# EAGLE design IrrigationManager (EAGLE 9.6.1)
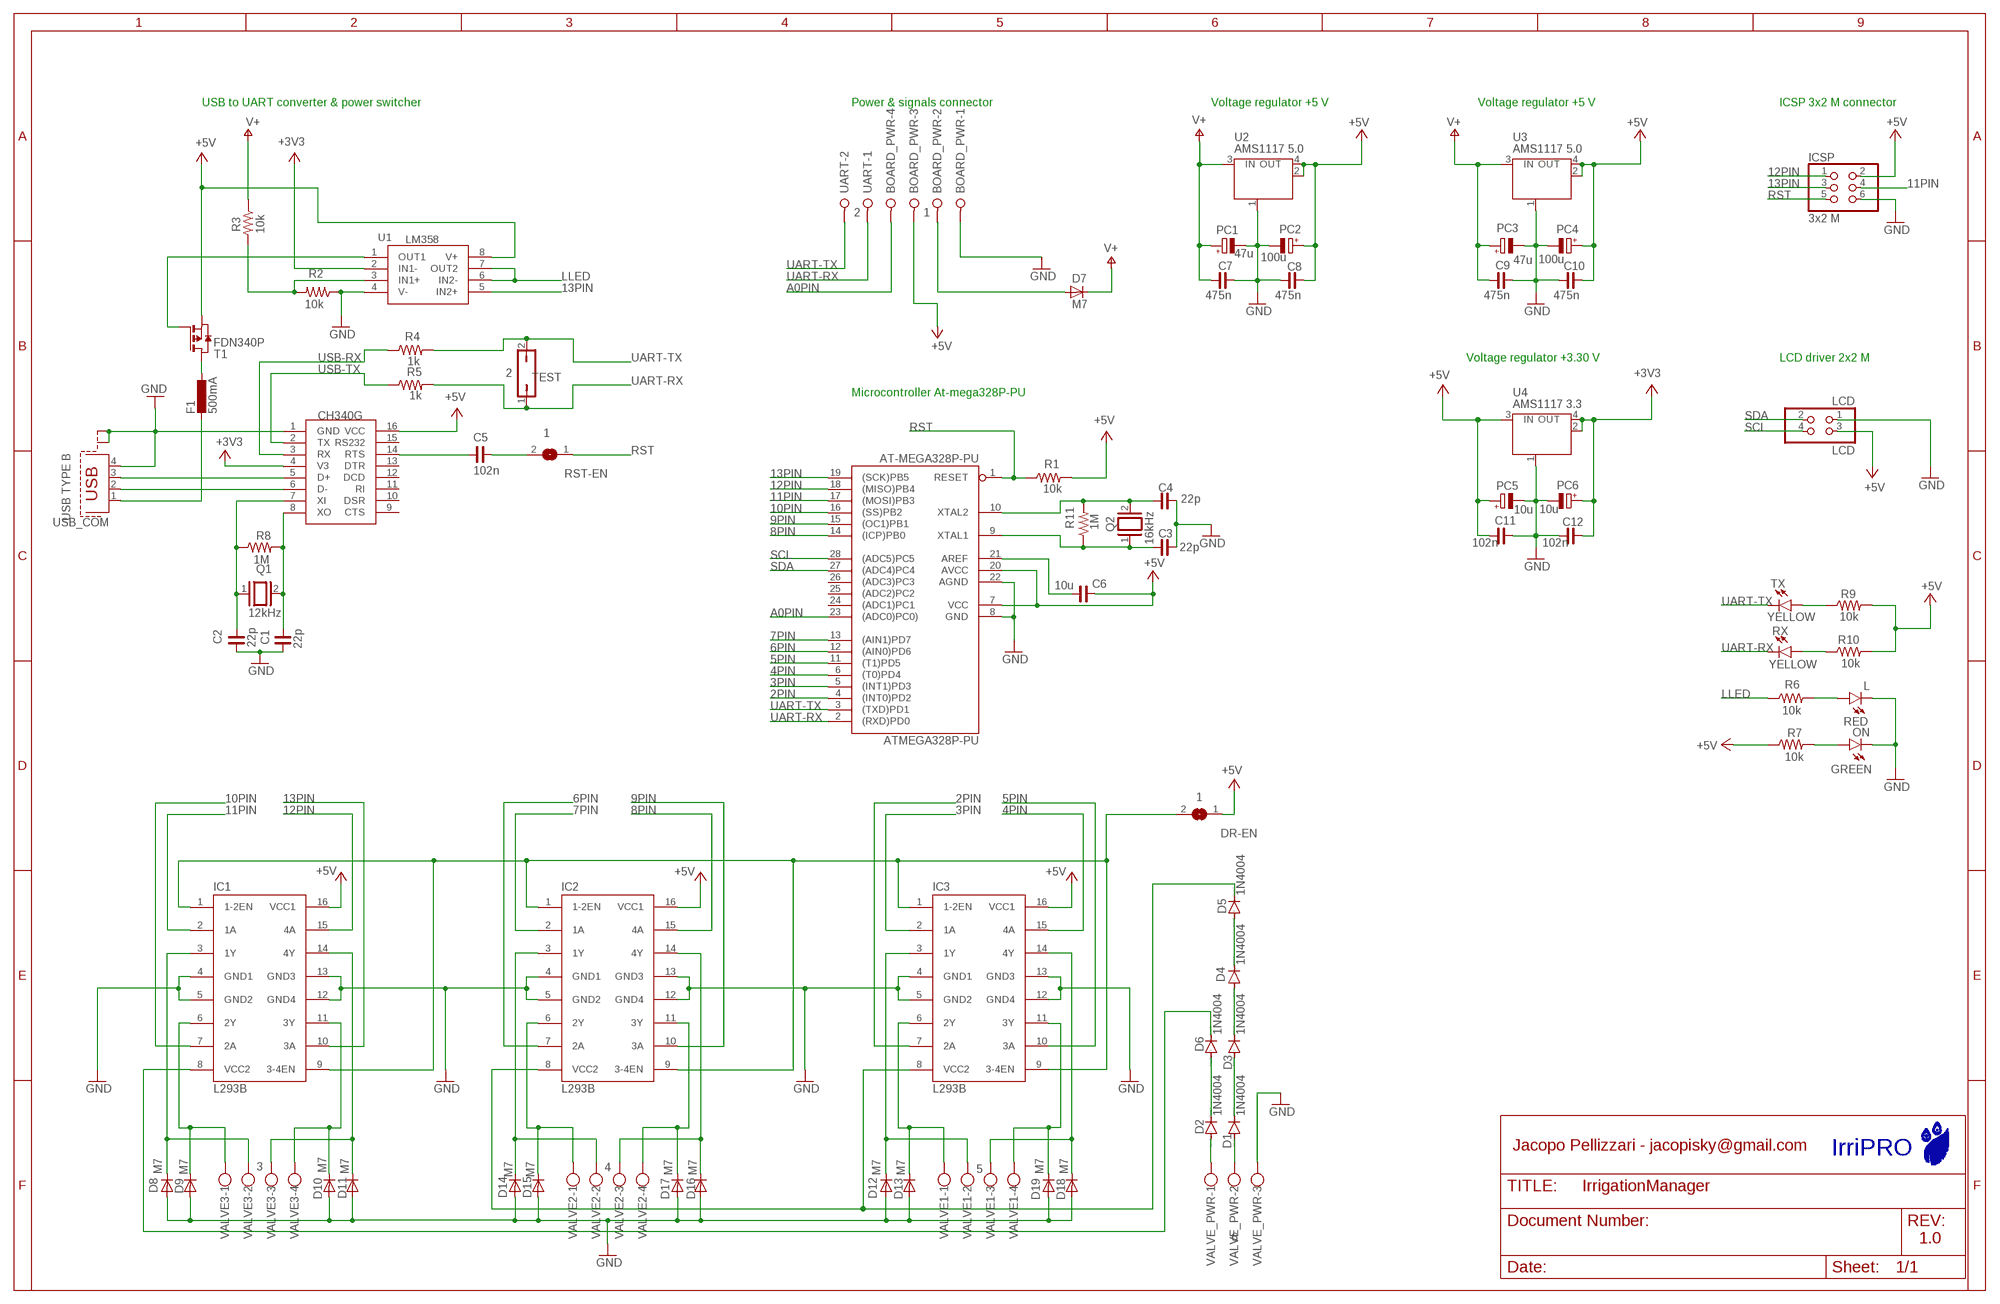
[diagram p0: schematic, sheet 1]

## Parts
AT-MEGA328P-PU  ATMEGA328P-PU  [DIL28-3]
BOARD_PWR  1  W237-04P  [W237-4P]
C1  22p  C_1206  [C1206]
C2  22p  C_1206  [C1206]
C3  22p  C_1206  [C1206]
C4  22p  C_1206  [C1206]
C5  102n  C_1206  [C1206]
C6  10u  C_1206  [C1206]
C7  475n  C_1206  [C1206]
C8  475n  C_1206  [C1206]
C9  475n  C_1206  [C1206]
C10  475n  C_1206  [C1206]
C11  102n  C_1206  [C1206]
C12  102n  C_1206  [C1206]
D1  1N4004  [DO41-10]
D2  1N4004  [DO41-10]
D3  1N4004  [DO41-10]
D4  1N4004  [DO41-10]
D5  1N4004  [DO41-10]
D6  1N4004  [DO41-10]
D7  M7  DIODE-SMB  [SMB]
D8  M7  DIODE-SMB  [SMB]
D9  M7  DIODE-SMB  [SMB]
D10  M7  DIODE-SMB  [SMB]
D11  M7  DIODE-SMB  [SMB]
D12  M7  DIODE-SMB  [SMB]
D13  M7  DIODE-SMB  [SMB]
D14  M7  DIODE-SMB  [SMB]
D15  M7  DIODE-SMB  [SMB]
D16  M7  DIODE-SMB  [SMB]
D17  M7  DIODE-SMB  [SMB]
D18  M7  DIODE-SMB  [SMB]
D19  M7  DIODE-SMB  [SMB]
DR-EN  1  SJ  [SJ]
F1  500mA  L-EUL1812  [L1812]
IC1  L293B  L293D  [DIL16]
IC2  L293B  L293D  [DIL16]
IC3  L293B  L293D  [DIL16]
ICSP  3x2 M  PINHD-2X3  [2X03]
L  RED  LEDCHIPLED_1206  [CHIPLED_1206]
LCD  LCD  PINHD-2X2  [2X02]
ON  GREEN  LEDCHIPLED_1206  [CHIPLED_1206]
PC1  47u  CPOL-EUD  [PANASONIC_D]
PC2  100u  CPOL-EUD  [PANASONIC_D]
PC3  47u  CPOL-EUD  [PANASONIC_D]
PC4  100u  CPOL-EUD  [PANASONIC_D]
PC5  10u  CPOL-EU153CLV-0405  [153CLV-0405]
PC6  10u  CPOL-EU153CLV-0405  [153CLV-0405]
Q1  12kHz  XTAL/S  [QS]
Q2  16kHz  XTAL/S  [QS]
R1  10k  ERJ-8GEY0R00V  [RES_1206]
R2  10k  ERJ-8GEY0R00V  [RES_1206]
R3  10k  ERJ-8GEY0R00V  [RES_1206]
R4  1k  ERJ-8GEY0R00V  [RES_1206]
R5  1k  ERJ-8GEY0R00V  [RES_1206]
R6  10k  ERJ-8GEY0R00V  [RES_1206]
R7  10k  ERJ-8GEY0R00V  [RES_1206]
R8  1M  ERJ-8GEY0R00V  [RES_1206]
R9  10k  ERJ-8GEY0R00V  [RES_1206]
R10  10k  ERJ-8GEY0R00V  [RES_1206]
R11  1M  ERJ-8GEY0R00V  [RES_1206]
RST-EN  1  SJ  [SJ]
RX  YELLOW  LEDCHIPLED_1206  [CHIPLED_1206]
T1  FDN340P  PMOSSOT23  [SOT-23]
TEST  2  JP1Q  [JP1]
TX  YELLOW  LEDCHIPLED_1206  [CHIPLED_1206]
U1  LM358  LM358DR  [LM358DR]
U2  AMS1117 5.0  MC33269ST-3.3T3  [SOT223]
U3  AMS1117 5.0  MC33269ST-3.3T3  [SOT223]
U4  AMS1117 3.3  MC33269ST-3.3T3  [SOT223]
U$1  CH340G  [SOIC16]
UART  2  W237-02P  [W237-132]
USB_COM  USB TYPE B  PN61729-S  [PN61729-S]
VALVE1  5  W237-04P  [W237-4P]
VALVE2  4  W237-04P  [W237-4P]
VALVE3  3  W237-04P  [W237-4P]
VALVE_PWR  6  W237-03P  [W237-133]

## Nets
2PIN: AT-MEGA328P-PU.4((INT0)PD2) IC3.7(2A)
3PIN: AT-MEGA328P-PU.5((INT1)PD3) IC3.2(1A)
4PIN: AT-MEGA328P-PU.6((T0)PD4) IC3.15(4A)
5PIN: AT-MEGA328P-PU.11((T1)PD5) IC3.10(3A)
5VP: T1.3(G) U1.1(OUT1)
6PIN: AT-MEGA328P-PU.12((AIN0)PD6) IC2.7(2A)
7PIN: AT-MEGA328P-PU.13((AIN1)PD7) IC2.2(1A)
8PIN: AT-MEGA328P-PU.14((ICP)PB0) IC2.15(4A)
9PIN: AT-MEGA328P-PU.15((OC1)PB1) IC2.10(3A)
10PIN: AT-MEGA328P-PU.16((SS)PB2) IC1.7(2A)
11PIN: AT-MEGA328P-PU.17((MOSI)PB3) IC1.2(1A) ICSP.4
12PIN: AT-MEGA328P-PU.18((MISO)PB4) IC1.15(4A) ICSP.1
13PIN: AT-MEGA328P-PU.19((SCK)PB5) IC1.10(3A) ICSP.3 U1.5(IN2+)
+3V3: C12.2 PC6.+ U1.2(IN1-) U4.2(OUT) U4.4(OUT) U$1.4(V3)
+5V: AT-MEGA328P-PU.7(VCC) AT-MEGA328P-PU.20(AVCC) BOARD_PWR.3 C6.2 C8.2 C10.2 C11.1 DR-EN.1 IC1.16(VCC1) IC2.16(VCC1) IC3.16(VCC1) ICSP.2 LCD.3 PC2.+ PC4.+ PC5.+ R1.2 R7.1 R9.2 R10.2 T1.2(S) U1.8(V+) U2.2(OUT) U2.4(OUT) U3.2(OUT) U3.4(OUT) U4.3(IN) U$1.16(VCC)
+9V: D6.C IC1.8(VCC2)
+9V7: D2.C D6.A
+10V4: D2.A VALVE_PWR.1
+20V: D5.C IC2.8(VCC2) IC3.8(VCC2)
+20V7: D4.C D5.A
+21V4: D3.C D4.A
+22V1: D1.C D3.A
+22V8: D1.A VALVE_PWR.2
A0PIN: AT-MEGA328P-PU.23((ADC0)PC0)) BOARD_PWR.4
CRST: C5.1 U$1.14(RTS)
DRIVEREN: DR-EN.2 IC1.1(1-2EN) IC1.9(3-4EN) IC2.1(1-2EN) IC2.9(3-4EN) IC3.1(1-2EN) IC3.9(3-4EN)
FUSE5V: F1.1 T1.1(D)
GND: AT-MEGA328P-PU.8(GND) AT-MEGA328P-PU.22(AGND) BOARD_PWR.1 C1.1 C2.1 C3.2 C4.2 C7.2 C8.1 C9.2 C10.1 C11.2 C12.1 D8.A D9.A D10.A D11.A D12.A D13.A D14.A D15.A D16.A D17.A D18.A D19.A IC1.4(GND1) IC1.5(GND2) IC1.12(GND4) IC1.13(GND3) IC2.4(GND1) IC2.5(GND2) IC2.12(GND4) IC2.13(GND3) IC3.4(GND1) IC3.5(GND2) IC3.12(GND4) IC3.13(GND3) ICSP.6 L.C LCD.1 ON.C PC1.- PC2.- PC3.- PC4.- PC5.- PC6.- R2.1 U1.4(V-) U2.1(GND/ADJ) U3.1(GND/ADJ) U4.1(GND/ADJ) U$1.1(GND) USB_COM.4 USB_COM.S1 USB_COM.S2 VALVE_PWR.3
HV2: D13.C IC3.6(2Y) VALVE1.1
HV3: D12.C IC3.3(1Y) VALVE1.2
HV4: D18.C IC3.14(4Y) VALVE1.3
HV5: D19.C IC3.11(3Y) VALVE1.4
HV6: D15.C IC2.6(2Y) VALVE2.1
HV7: D14.C IC2.3(1Y) VALVE2.2
HV8: D16.C IC2.14(4Y) VALVE2.3
HV9: D17.C IC2.11(3Y) VALVE2.4
HV10: D9.C IC1.6(2Y) VALVE3.1
HV11: D8.C IC1.3(1Y) VALVE3.2
HV12: D11.C IC1.14(4Y) VALVE3.3
HV13: D10.C IC1.11(3Y) VALVE3.4
LLED: R6.1 U1.6(IN2-) U1.7(OUT2)
N$2: C1.2 Q1.2 R8.2 U$1.8(XO)
N$3: C2.2 Q1.1 R8.1 U$1.7(XI)
N$4: U$1.6(D-) USB_COM.2
N$5: AT-MEGA328P-PU.9(XTAL1) C3.1 Q2.1 R11.1
N$6: AT-MEGA328P-PU.10(XTAL2) C4.1 Q2.2 R11.2
N$7: U$1.5(D+) USB_COM.3
N$14: R2.2 R3.2 U1.3(IN1+)
N$16: C5.2 RST-EN.2
N$30: R9.1 TX.A
N$51: R10.1 RX.A
N$54: AT-MEGA328P-PU.21(AREF) C6.1
P13LED: L.A R6.2
PWRLED: ON.A R7.2
RST: AT-MEGA328P-PU.1(RESET) ICSP.5 R1.1 RST-EN.1
SCL: AT-MEGA328P-PU.28((ADC5)PC5) LCD.4
SDA: AT-MEGA328P-PU.27((ADC4)PC4) LCD.2
UART-RX: AT-MEGA328P-PU.2((RXD)PD0) R5.2 RX.C TEST.1 UART.1
UART-TX: AT-MEGA328P-PU.3((TXD)PD1) R4.2 TEST.2 TX.C UART.2
USB5V: F1.2 USB_COM.1
USB-RX: R4.1 U$1.3(RX)
USB-TX: R5.1 U$1.2(TX)
V+: C7.1 C9.1 D7.C PC1.+ PC3.+ R3.1 U2.3(IN) U3.3(IN)
VIN: BOARD_PWR.2 D7.A
Unconnected: AT-MEGA328P-PU.24((ADC1)PC1) AT-MEGA328P-PU.25((ADC2)PC2) AT-MEGA328P-PU.26((ADC3)PC3) U$1.9(CTS) U$1.10(DSR) U$1.11(RI) U$1.12(DCD) U$1.13(DTR) U$1.15(RS232)

## Notes on the sheet
- USB to UART converter & power switcher | Power & signals connector | Voltage regulator +5 V | Voltage regulator +5 V | ICSP 3x2 M connector
- Voltage regulator +3.30 V | LCD driver 2x2 M
- Microcontroller At-mega328P-PU
- Jacopo Pellizzari - jacopisky@gmail.com
- IrriPRO
- 1.0

## Library data of the parts
AT-MEGA328P-PU = SmartPrj:ATMEGA328P-: MICROCONTROLLER 4 Kbytes FLASH 128 bytes SRAM 256 bytes EEPROM UART 6-channel 10 bit ADC
BOARD_PWR = con-wago-508:W237-04P: WAGO SREW CLAMP; OC_FARNELL: unknown; OC_NEWARK: unknown
C1-C12 = rc-master-smd:C_: NON-POLARIZED CAP
D1-D6 = diode:1N4004: DIODE general purpose rectifier, 1 A
D7-D19 = diode:DIODE-: DIODE
DR-EN RST-EN = jumper:SJ: SMD solder JUMPER
F1 = rcl:L-EU: INDUCTOR, European symbol
IC1-IC3 = st-microelectronics:L293D: PUSH-PULL 4 CHANNEL DRIVER; MPN: L293D; OC_FARNELL: 9589619; OC_NEWARK: 56P8249
ICSP = SmartPrj:PINHD-2X3: PIN HEADER
L ON RX TX = led:LED: LED OSRAM: - CHIPLED LG R971, LG N971, LY N971, LG Q971, LY Q971, LO R971, LY R971 LH N974, LH R974 LS Q976, LO Q976, LY Q976 LO Q996 - Hyper CHIPLED LW Q18S LB Q993, LB Q99A, LB R99A - SideLED LS A670, LO A670, LY A670, LG A670, LP A670 LB A673, LV A673, LT A673, LW A673 LH A674 LY A675 LS A676, LA A676, LO A676, LY A676, LW A676 LS A679, LY A679, LG A679 - Hyper Micro SIDELED® LS Y876, LA Y876, LO Y876, LY Y876 LT Y87S - SmartLED LW L88C, LW L88S LB L89C, LB L89S, LG L890 LS L89K, LO L89K, LY L89K LS L896, LA L896, LO L896, LY L896 - TOPLED LS T670, LO T670, LY T670, LG T670, LP T670 LSG T670, LSP T670, LSY T670, LOP T670, LYG T670 LG T671, LOG T671, LSG T671 LB T673, LV T673, LT T673, LW T673 LH T674 LS T676, LA T676, LO T676, LY T676, LB T676, LH T676, LSB T676, LW T676 LB T67C, LV T67C, LT T67C, LS T67K, LO T67K, LY T67K, LW E67C LS E67B, LA E67B, LO E67B, LY E67B, LB E67C, LV E67C, LT E67C LW T67C LS T679, LY T679, LG T679 LS T770, LO T770, LY T770, LG T770, LP T770 LB T773, LV T773, LT T773, LW T773 LH T774 LS E675, LA E675, LY E675, LS T675 LS T776, LA T776, LO T776, LY T776, LB T776 LHGB T686 LT T68C, LB T68C - Hyper Mini TOPLED® LB M676 - Mini TOPLED Santana® LG M470 LS M47K, LO M47K, LY M47K Source: http://www.osram.convergy.de LUXEON: - LUMILED® LXK2-PW12-R00, LXK2-PW12-S00, LXK2-PW14-U00, LXK2-PW14-V00 LXK2-PM12-R00, LXK2-PM12-S00, LXK2-PM14-U00 LXK2-PE12-Q00, LXK2-PE12-R00, LXK2-PE12-S00, LXK2-PE14-T00, LXK2-PE14-U00 LXK2-PB12-K00, LXK2-PB12-L00, LXK2-PB12-M00, LXK2-PB14-N00, LXK2-PB14-P00, LXK2-PB14-Q00 LXK2-PR12-L00, LXK2-PR12-M00, LXK2-PR14-Q00, LXK2-PR14-R00 LXK2-PD12-Q00, LXK2-PD12-R00, LXK2-PD12-S00 LXK2-PH12-R00, LXK2-PH12-S00 LXK2-PL12-P00, LXK2-PL12-Q00, LXK2-PL12-R00 Source: www.luxeon.com KINGBRIGHT: KA-3528ASYC Source: www.kingbright.com
LCD = SmartPrj:PINHD-2X2: PIN HEADER
PC1-PC4 = rcl:CPOL-EU: POLARIZED CAPACITOR, European symbol
PC5 PC6 = rcl:CPOL-EU: POLARIZED CAPACITOR, European symbol; SPICEPREFIX: C
Q1 Q2 = special:XTAL/S: CRYSTAL
R1-R11 = Resistor_Capacitor:ERJ-8GEY0R00V: RES SMD 0 OHM JUMPER 1/4W 1206 Manufacturer's datasheet <https://industrial.panasonic.com/ww/products/resistors/chip-resistors/general-purpose-chip-resistors/thick-film-chip-resistors/ERJ8GEY0R00V>; CREATED_BY: PCBLayout.com; DIGIKEY_PART_NUMBER: P0.0ETR-ND; MANUFACTURER: Panasonic Electronic Components; MPN: ERJ-8GEY0R00V; PACKAGE: SMD 1206
T1 = zetex:PMOSSOT23: MOS FET
TEST = jumper:JP1Q: JUMPER
U1 = IC:LM358DR: IC OPAMP GP 2 CIRCUIT 8SOIC Manufacturer's datasheet <http://www.ti.com/lit/ds/symlink/lm358.pdf>; CREATED_BY: PCBLayout.com; DIGIKEY_PART_NUMBER: 296-1014-1-ND; MANUFACTURER: Texas Instruments; MPN: LM358DR; PACKAGE: 8-SOIC
U2-U4 = linear:MC33269ST*: Adjustable Output Low Dropout Voltage Regulator 800 mA Source: http://www.onsemi.com/pub/Collateral/MC33269-D.PDF
U$1 = ch340g:CH340G
UART = con-wago-508:W237-02P: WAGO SREW CLAMP; OC_FARNELL: unknown; OC_NEWARK: unknown
USB_COM = con-berg:PN61729-S: BERG USB connector; OC_FARNELL: unknown; OC_NEWARK: unknown
VALVE1-VALVE3 = con-wago-508:W237-04P: WAGO SREW CLAMP
VALVE_PWR = con-wago-508:W237-03P: WAGO SREW CLAMP

## Board
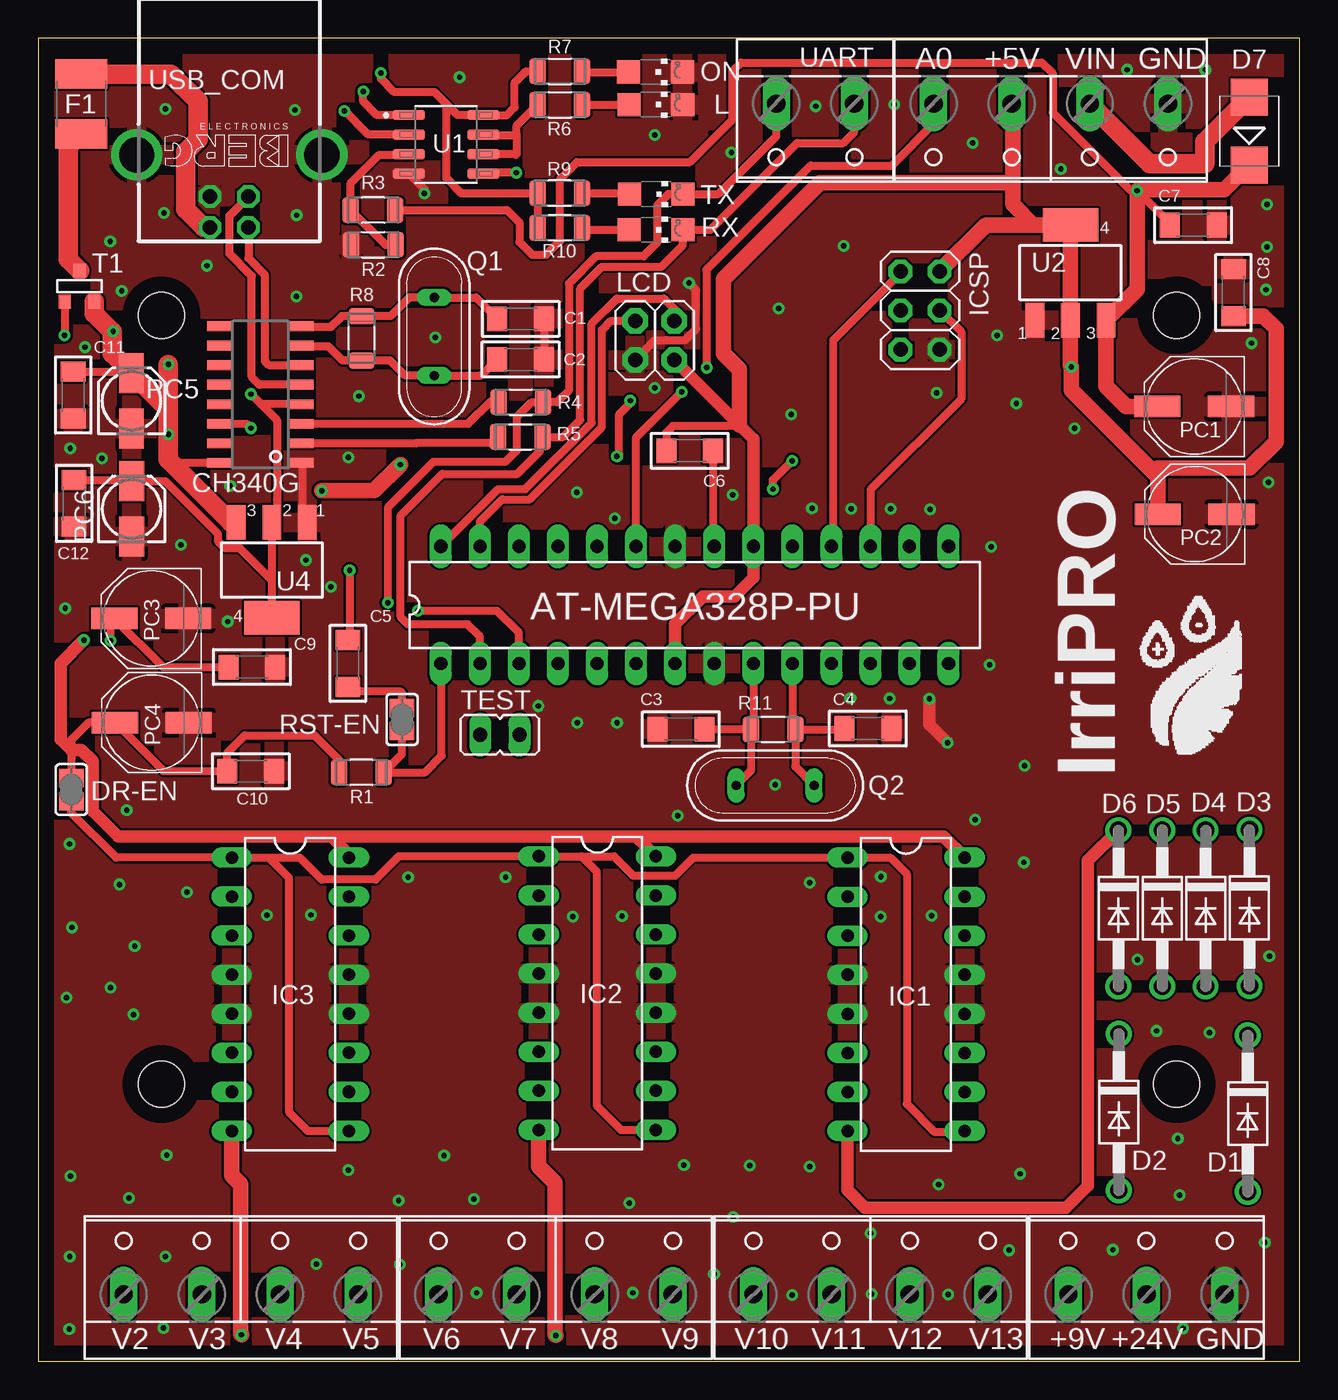
[diagram p1: board, top side]
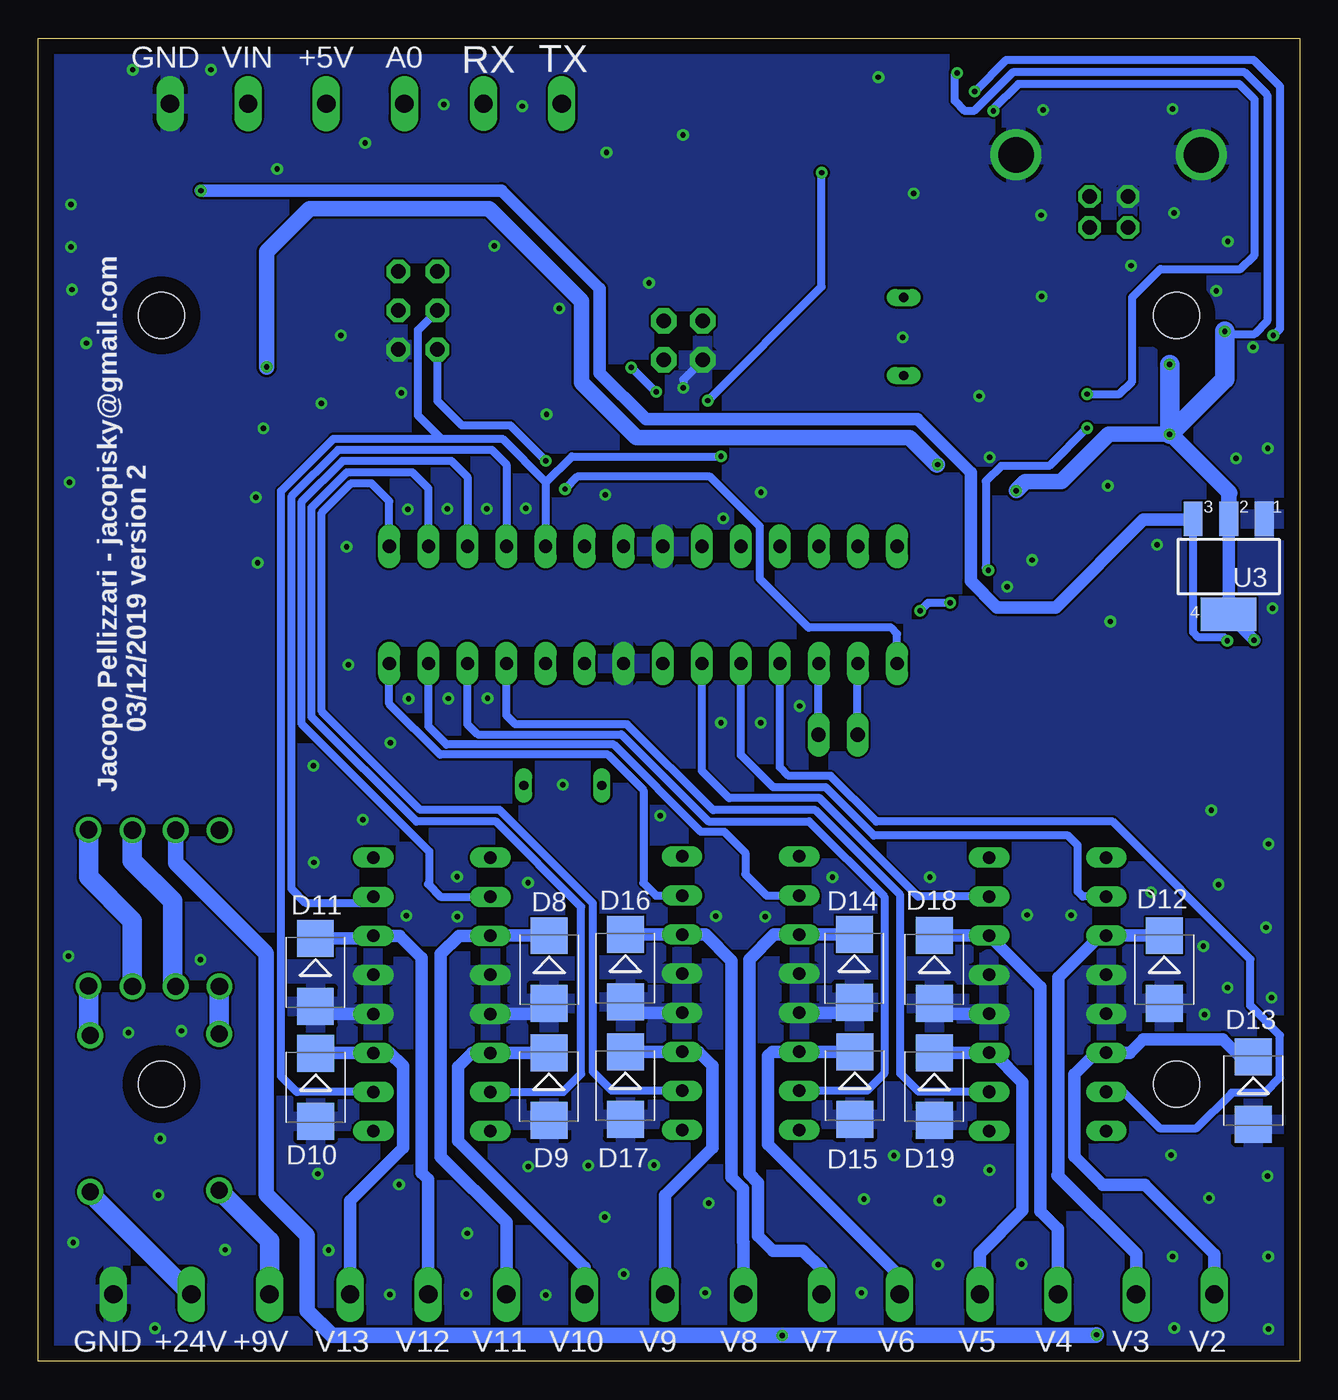
[diagram p2: board, bottom side, seen from below]

Size 82 x 86 mm. Coordinates in mm from the lower left corner, seen from the top.
Outline: 0,0 82,0 82,86 0,86 0,0
Copper layers (1*16): Top 0.035mm / dielectric 1.5mm / Bottom 0.035mm
Design rules "default": minimum track width 6mil, minimum drill 0.35mm, track to track 6mil, track to pad 6mil, pad to pad 6mil, via to via 6mil, smd to smd 6mil, copper to edge 40mil, drill to drill 6mil, minimum pad ring 10mil, minimum via ring 8mil, stop-mask expansion 4mil, vias tented up to drill 0mil, thermal gap 10mil
Holes 3 mm at 8,18 74,18 74,68 8,68

### Footprints (pad centres in the part's own frame; a part is rotated, then mirrored left to right if it is on the bottom)
DIL28-3 = drill 0.85 pad 1.422 long: 1 -16.51,-3.81; 2 -13.97,-3.81; 3 -11.43,-3.81; 4 -8.89,-3.81; 5 -6.35,-3.81; 6 -3.81,-3.81; 7 -1.27,-3.81; 8 1.27,-3.81; 9 3.81,-3.81; 10 6.35,-3.81; 11 8.89,-3.81; 12 11.43,-3.81; 13 13.97,-3.81; 14 16.51,-3.81; 15 16.51,3.81; 16 13.97,3.81; 17 11.43,3.81; 18 8.89,3.81; 19 6.35,3.81; 20 3.81,3.81; 21 1.27,3.81; 22 -1.27,3.81; 23 -3.81,3.81; 24 -6.35,3.81; 25 -8.89,3.81; 26 -11.43,3.81; 27 -13.97,3.81; 28 -16.51,3.81
W237-4P = drill 1.194 long: 1 -7.62,-0.635; 2 -2.54,-0.635; 3 2.54,-0.635; 4 7.62,-0.635
C1206 = smd 1.3 x 1.6: 1 -1.524,0; 2 1.524,0
DO41-10 = drill 1.118: A 5.08,0; C -5.08,0
SMB = smd 2.4 x 2.4: A 2.2,0; C -2.2,0
SJ = smd 1.168 x 1.6: 1 -0.762,0; 2 0.762,0
L1812 = smd 1.9 x 3.4: 1 -1.95,0; 2 1.95,0
DIL16 = drill 0.813 long: 1 -8.89,-3.81; 2 -6.35,-3.81; 3 -3.81,-3.81; 4 -1.27,-3.81; 5 1.27,-3.81; 6 3.81,-3.81; 7 6.35,-3.81; 8 8.89,-3.81; 9 8.89,3.81; 10 6.35,3.81; 11 3.81,3.81; 12 1.27,3.81; 13 -1.27,3.81; 14 -3.81,3.81; 15 -6.35,3.81; 16 -8.89,3.81
2X03 = drill 0.95 pad 1.55 octagon: 1 -2.54,-1.27; 2 -2.54,1.27; 3 0,-1.27; 4 0,1.27; 5 2.54,-1.27; 6 2.54,1.27
CHIPLED_1206 = smd 1.5 x 1.5: A 0,-1.75; C 0,1.75
2X02 = drill 0.95 pad 1.676 octagon: 1 -1.27,-1.27; 2 -1.27,1.27; 3 1.27,-1.27; 4 1.27,1.27
PANASONIC_D = smd 3 x 1.4: + 2.4,0; - -2.4,0
153CLV-0405 = smd 2.6 x 1.6: + 1.8,0; - -1.8,0
QS = drill 0.61 long: 1 -2.54,0; 2 2.54,0
RES_1206 = smd 1.08 x 1.68: 1 -1.445,0; 2 1.445,0
SOT-23 = smd 0.787 x 0.889: 1 0.025,-1.016; 2 -0.94,1.016; 3 0.991,1.016
JP1 = drill 0.914 long: 1 0,-1.27; 2 0,1.27
LM358DR = smd 0.66 x 2.07: 1 -1.905,-2.42; 2 -0.635,-2.42; 3 0.635,-2.42; 4 1.905,-2.42; 5 1.905,2.42; 6 0.635,2.42; 7 -0.635,2.42; 8 -1.905,2.42
SOT223 = smd 1.219 x 2.235: 1 -2.311,-3.099; 2 0,-3.099; 3 2.311,-3.099 | smd 3.6 x 2.2: 4 0,3.099
SOIC16 = smd 0.635 x 1.524: 1 -4.445,-2.695; 2 -3.175,-2.695; 3 -1.905,-2.695; 4 -0.635,-2.695; 5 0.635,-2.695; 6 1.905,-2.695; 7 3.175,-2.695; 8 4.445,-2.695; 9 4.445,2.695; 10 3.175,2.695; 11 1.905,2.695; 12 0.635,2.695; 13 -0.635,2.695; 14 -1.905,2.695; 15 -3.175,2.695; 16 -4.445,2.695
W237-132 = drill 1.194 long: 1 -2.54,-0.635; 2 2.54,-0.635
PN61729-S = drill 0.95 octagon: 1 1.25,4.71; 2 -1.25,4.71; 3 -1.25,2.71; 4 1.25,2.71 | drill 2.3 pad 2.9: S1 -6.02,0; S2 6.02,0
W237-133 = drill 1.194 long: 1 -5.08,-0.635; 2 0,-0.635; 3 5.08,-0.635

### Placement (x,y rotation side)
AT-MEGA328P-PU  42.67,49.17 0 top
BOARD_PWR  65.83,81.12 180 top
C1  31.36,67.77 180 top
C2  31.35,65.13 180 top
C3  41.78,41.09 180 top
C4  53.93,41.13 0 top
C5  20.12,45.36 270 top
C6  42.35,59.19 180 top
C7  75.09,73.86 0 top
C8  77.7,69.48 270 top
C9  13.88,45.12 0 top
C10  13.81,38.35 180 top
C11  2.26,62.82 270 top
C12  2.32,55.77 90 top
D1  78.63,16.09 270 top
D2  70.25,16.18 270 top
D3  78.75,29.46 270 top
D4  75.89,29.43 270 top
D5  73.07,29.44 270 top
D6  70.23,29.44 270 top
D7  78.73,79.97 90 top
D8  48.79,25.46 270 bottom
D9  48.81,17.85 270 bottom
D10  63.98,17.79 270 bottom
D11  63.99,25.27 270 bottom
D12  8.79,25.46 270 bottom
D13  3.01,17.59 270 bottom
D14  28.95,25.53 270 bottom
D15  28.92,17.92 270 bottom
D16  43.84,25.54 270 bottom
D17  43.83,17.91 270 bottom
D18  23.75,25.47 270 bottom
D19  23.75,17.84 270 bottom
DR-EN  2.14,37.16 270 top
F1  2.78,81.74 90 top
IC1  56.42,23.84 270 top
IC2  36.34,23.92 270 top
IC3  16.37,23.85 270 top
ICSP  57.33,68.32 270 top
L  40.14,81.7 270 top
LCD  40.08,66.37 0 top
ON  40.13,83.82 270 top
PC1  75.15,62.07 180 top
PC2  75.18,55.07 180 top
PC3  7.34,48.29 180 top
PC4  7.38,41.51 180 top
PC5  6.06,62.43 90 top
PC6  6.07,55.4 90 top
Q1  25.73,66.62 90 top
Q2  47.9,37.43 0 top
R1  20.99,38.28 180 top
R2  21.76,72.59 0 top
R3  21.76,74.84 180 top
R4  31.36,62.34 0 top
R5  31.34,60.09 0 top
R6  33.91,81.69 0 top
R7  33.91,83.86 0 top
R8  21.01,66.51 90 top
R9  33.89,75.94 180 top
R10  33.89,73.68 180 top
R11  47.77,41.07 0 top
RST-EN  23.64,41.72 90 top
RX  40.16,73.56 270 top
T1  2.69,69.9 180 top
TEST  30,40.72 270 top
TX  40.17,75.88 270 top
U1  26.51,79.12 270 top
U2  67.1,70.78 0 top
U3  4.61,51.66 180 bottom
U4  15.17,51.43 180 top
U$1  14.44,62.85 90 top
UART  50.51,81.12 180 top
USB_COM  12.41,78.43 180 top
VALVE1  13.16,4.98 0 top
VALVE2  33.63,4.97 0 top
VALVE3  54.11,4.97 0 top
VALVE_PWR  72.05,4.98 0 top

### Tracks (layer width: path | path; a pad name or v marks a point on that pad's centre or on a via)
2PIN
  Bottom 0.508: IC3.7 11.47,17.5 9.1,15.14 6.7,15.14 4.42,17.42 4.42,17.47 2.24,17.47 1.27,18.44 1.27,21.18 3.21,23.12 3.2,26.13 12.14,35.07 27.51,35.07 30.49,38.05 33.22,38.05 33.78,38.62 AT-MEGA328P-PU.4
3PIN
  Bottom 0.508: IC3.2 14.1,30.2 14.42,30.53 14.42,33.54 15.05,34.17 27.68,34.17 30.81,37.3 34.22,37.3 36.32,39.41 AT-MEGA328P-PU.5
4PIN
  Bottom 0.508: IC3.15 24.8,30.2 31.2,36.6 37.1,36.6 38.86,38.37 AT-MEGA328P-PU.6
5PIN
  Bottom 0.508: IC3.10 24.76,17.5 25.96,18.7 25.96,30.29 31.49,35.82 38.13,35.82 43.71,41.41 50.98,41.41 51.56,41.99 AT-MEGA328P-PU.11
5VP  (via drill 0.35)
  Top 0.508: T1.3 v1.7,66.68 | U1.1 22,81.02 21.12,81.91 v21.12,82.55
  Bottom 0.508: v1.7,66.68 1.28,67.11 1.28,82.88 2.98,84.58 19.08,84.58 v21.12,82.55
6PIN
  Bottom 0.508: IC2.7 28.12,17.57 26.99,18.7 26.99,30.2 31.89,35.09 38.45,35.09 44.1,40.75 53.45,40.75 54.1,41.41 AT-MEGA328P-PU.12
7PIN
  Bottom 0.508: IC2.2 34.65,30.27 36.03,31.66 36.03,33.04 37.42,34.44 38.94,34.44 44.59,40.09 55.46,40.09 56.64,41.27 AT-MEGA328P-PU.13
8PIN
  Bottom 0.508: IC2.15 41.85,30.27 42.67,31.09 42.67,37.12 44.97,39.43 55.88,39.43 59.18,42.74 AT-MEGA328P-PU.14
9PIN
  Bottom 0.508: IC2.10 44.71,17.57 45.95,18.82 45.95,29.77 52.02,35.84 57.18,35.84 63.58,42.24 63.58,55.16 61.66,57.08 60.35,57.08 59.18,55.91 AT-MEGA328P-PU.15
10PIN
  Bottom 0.508: IC1.7 47.89,17.49 46.71,18.67 46.71,29.54 52.24,35.07 57.43,35.07 64.25,41.89 64.25,55.49 61.94,57.8 57.7,57.8 56.66,56.76 56.66,54.01 56.64,54 AT-MEGA328P-PU.16
11PIN
  Top 0.508: ICSP.4 58.62,68.31 60,66.94 60,62.56 54.1,56.66 AT-MEGA328P-PU.17
  Bottom 0.508: IC1.2 55.85,30.19 56.67,31.01 56.59,31.1 56.59,33.14 64.91,41.46 64.91,55.85 62.23,58.52 55.14,58.52 54.1,57.49 AT-MEGA328P-PU.17
12PIN
  Top 0.508: ICSP.1 56.06,70.75 51.67,66.36 51.67,53.09 AT-MEGA328P-PU.18
  Bottom 0.508: IC1.15 60.62,29.8 64.64,29.8 65.57,30.73 65.57,56.2 62.52,59.25 52.52,59.25 51.56,58.29 AT-MEGA328P-PU.18
13PIN  (via drill 0.35)
  Top 0.508: v37.62,58.83 37.77,58.97 37.77,61.55 38.48,62.27 v38.48,62.45 | v31.07,77.27 28.99,77.27 U1.5
  Bottom 0.508: v37.62,58.83 47.31,58.83 49.02,57.11 | v38.48,62.45 31.07,69.85 v31.07,77.27 | IC1.10 65.2,17.49 66.23,18.52 66.23,25.37 66.23,56.57 62.82,59.98 55.83,59.98 | 55.83,59.98 51.84,59.98 49.02,57.17 49.02,57.11 | 49.02,57.11 AT-MEGA328P-PU.19 | 55.83,59.98 57.32,61.48 57.32,67.05 ICSP.3
+3V3  (via drill 0.35)
  Top 0.508: U$1.4 14.48,62.22 v13.82,62.87 15.52,61.17 15.52,56 15.52,54.87 U4.2 15.17,50.79 | 15.17,50.79 U4.4 | C12.2 5.97,57.3 PC6.+ 8.24,57.2 11.65,53.79 11.65,53.32 12.11,52.87 13.1,52.87 15.17,50.79 | U1.2 21.45,79.75 v19.9,81.3
  Bottom 0.508: v13.82,62.87 11.71,62.87 10.88,63.7 10.88,69.17 9.04,71 3.83,71 2.92,71.92 2.92,82.02 3.93,83.03 18.29,83.03 19.9,81.42 v19.9,81.3
+5V  (via drill 0.35)
  Top 0.508: v22.27,83.77 22.27,83.37 23.13,82.51 25.75,82.51 26.55,81.72 | 26.55,81.72 27.24,81.02 U1.8 30.48,81.02 30.97,81.52 30.97,83.13 31.71,83.86 R7.1 | C11.1 5.95,64.34 PC5.+ | 26.55,81.72 26.55,76.92 26.52,76.9 27.49,75.94 R9.2 R10.2 | R1.2 19.55,39.09 17.96,40.68 13.42,40.68 12.28,39.54 C10.2 8.13,38.35 PC4.+ 3.25,41.51 2.13,40.38 2.13,39.74 2.13,37.93 DR-EN.1 | U$1.16 8.67,58.41 8.44,58.63 | 45.59,60.85 45.53,60.8 41.25,60.8 40.83,60.37 C6.2 | v67.16,64.64 67.16,64.67 67.1,64.73
  Top 0.813: v2.95,46.88 1.44,45.37 1.44,40.42 2.13,39.74 2.79,39.74 3.53,39.01 3.53,35.77 5.19,34.11 19.04,34.11 | 19.04,34.11 | IC3.16 20.18,32.96 19.04,34.11 | 19.04,34.11 38.92,34.11 | 38.92,34.11 39.07,33.95 39.07,33.89 IC2.16 | 38.92,34.11 58.85,34.11 IC1.16 | AT-MEGA328P-PU.7 41.4,47.92 43.21,49.72 45.26,49.72 46.48,50.94 AT-MEGA328P-PU.20 46.48,59.96 45.59,60.85 LCD.3
  Top 1.016: 64.7,73.87 63.35,75.22 63.35,76.45 | 63.35,76.45 63.35,81.69 BOARD_PWR.3 | 45.59,60.85 45.59,64.46 44.55,65.5 44.55,70.33 50.83,76.62 63.19,76.62 63.35,76.45 | v18.43,56.59 21.83,56.59 v23.54,58.29 | 67.1,64.73 U2.2 U2.4 64.7,73.87 | 72.78,57.52 72.78,58.05 78.73,58.05 80.48,59.79 80.48,67.12 79.64,67.96 C8.2 | 72.78,57.52 PC2.+ | 72.78,57.52 67.16,63.14 v67.16,64.64 | ICSP.2 61.62,73.87 64.7,73.87
  Top 1.27: T1.2 3.63,68.1 4.79,66.94 4.79,65.5 PC5.+ 8.44,61.85 | 8.44,61.85 v8.44,60.27 8.44,58.63 12.55,54.53 U4.3 | 8.44,61.85 v8.44,64.8 v8.45,64.8
  Bottom 0.508: v4.86,66.96 4.68,66.79 2.92,66.79 2.1,67.61 2.1,82.33 3.57,83.8 18.64,83.8 21.18,81.27 21.75,81.27 22.42,81.94 22.42,83.61 v22.27,83.77
  Bottom 0.813: v2.95,46.88 4.61,48.54 U3.4 U3.2
  Bottom 1.016: U3.2 4.61,56.39 4.54,56.45 8.36,60.27 v8.44,60.27 12.4,60.27 15.49,57.18 17.83,57.18 v18.43,56.59 | v23.54,58.29 23.57,58.26 25.38,60.06 43.11,60.06 46.68,63.63 46.68,68.93 52.69,74.93 64.38,74.93 67.16,72.14 v67.16,64.64
  Bottom 1.27: v4.86,66.96 4.86,63.85 v8.44,60.27 v8.45,60.27 v8.45,64.8
+9V
  Top 0.813: D6.C 68.25,32.54 68.25,11.4 66.8,9.96 53.76,9.96 52.59,11.12 52.59,14.94 IC1.8
+9V7
  Bottom 1.27: D6.A 70.25,24.33 D2.C
+10V4
  Bottom 1.27: VALVE_PWR.1 66.97,7.83 D2.A
+20V  (via drill 0.35)
  Top 1.016: IC3.8 12.56,12.09 13.16,11.49 13.16,1.75 v13.2,1.71 | IC2.8 32.53,12.65 33.6,11.58 33.6,1.71 v33.65,1.67
  Bottom 1.016: D5.C 73.07,32.38 67.19,26.5 67.19,10.85 64.53,8.18 64.53,3.28 62.91,1.67 v33.65,1.67 33.63,1.67 13.25,1.67 v13.2,1.71
+20V7
  Bottom 1.27: D4.C 75.89,32.53 73.27,29.9 73.27,24.56 D5.A
+21V4
  Bottom 1.27: D3.C 78.75,31.48 75.89,28.63 D4.A
+22V1
  Bottom 0.152: 78.79,21.33 D1.C
  Bottom 1.27: D3.A 78.75,21.38 78.79,21.33
+22V8
  Bottom 1.27: VALVE_PWR.2 78.63,10.92 D1.A
A0PIN  (via drill 0.35)
  Top 0.508: AT-MEGA328P-PU.23 38.86,60.05 v41.84,63.02 | v43.45,64.6 43.43,64.62 43.43,70.96 50.21,77.74 55.49,77.74 58.21,80.45 BOARD_PWR.4
  Bottom 0.508: v41.84,63.02 41.87,63.02 v43.45,64.6
CRST  (via drill 0.35)
  Top 0.508: U$1.14 13.54,60.95 v13.82,60.67 | v20.23,51.41 20.23,46.99 C5.1
  Bottom 0.508: v13.82,60.67 16.27,58.21 19.4,58.21 20.4,57.21 20.4,51.58 v20.23,51.41
DRIVEREN
  Top 0.508: IC3.1 5.05,32.74 2.14,35.65 DR-EN.2 | IC3.1 16.99,32.74 18.42,31.31 21.93,31.31 23.43,32.81 IC2.1 35.32,32.81 | IC3.1 14.97,32.74 16.27,31.44 16.27,16.2 17.51,14.96 IC3.9 | IC1.9 60.19,14.91 58.25,14.91 56.45,16.71 56.45,31.67 55.39,32.73 IC1.1 52.6,32.75 42.59,32.75 41.42,31.58 38.67,31.58 37.44,32.81 35.32,32.81 | 35.32,32.81 36.3,31.83 36.3,16.63 37.9,15.03 IC2.9
FUSE5V
  Top 1.27: F1.1 1.94,78.95 1.94,71.65 T1.1
GND  (via drill 0.35)
  Top 0.508: C1.1 32.88,65.14 C2.1 | U$1.1 17.13,54.88 U4.1 | U1.4 25.1,76.2 v25.1,75.92 | LCD.1 40.1,66.39 40.83,66.39 42.05,66.39 42.77,67.11 42.77,69.63 v42.3,70.1
  Top 0.813: v57.93,43.06 57.93,41.4 v59.12,40.22
  Bottom 0.508: LCD.1 40.07,63.83 v40.07,63.29 | v16.77,69.22 v16.78,69.23
  Bottom 0.813: IC3.12 22.89,22.58 23.58,23.27 D18.A | IC2.5 29.63,22.65 D14.A | IC1.5 49.48,22.57 D8.A | IC2.12 43.15,22.65 D16.A | IC1.12 63.49,22.57 D11.A
  other vias: 40.09,79.72 70.8,83.96 75.87,83.96 79.89,75.22 79.89,72.44 79.83,69.66 78.89,66.19 79.98,57.14 8.15,74.65 79.74,7.69 74.43,2.13 72.7,21.47 76.14,21.36 74.08,14.46 74.2,10.79 69.86,7.23 71.47,26.09 80.04,26.32 20.83,62.75 25.8,66.56 8.26,81.42 16.67,81.36 16.79,74.51 2.07,59.34 4.13,58.69 27.39,83.48 47.91,37.46 1.74,48.95 9.26,53.08 12.3,48.09 45.13,56.34 66.48,77.51 63.59,62.27 37.48,54.8 50.54,81.6 55.64,81.71 45.06,78.58 60.76,79.2 35.02,56.48 17.39,52.08 5.41,69.59 2.09,12.02 8.34,13.39 2.03,6.81 63.13,7.21 63.84,12.18 52.36,72.5 48.14,68.45 48.96,61.57 41.97,12.73 46.25,12.7 50.14,12.64 45.17,9.37 43.93,5.65 8.25,6.8 18.07,6.32 23.51,6.27 5.74,35.82 2.01,33.62 6.18,22.54 6.26,26.97 4.67,24.27 5.88,10.6 2,2.07 8.14,2.15 20.16,12.43 26.38,13.36 28.32,10.52 23.42,10.44 28.49,4.44 38.42,10.27 38.63,4.44 49.01,4.3 54.11,8.31 58.55,11.48 54.18,4.37 59.14,4.33 4.67,72.81 3.03,65.93 10.96,71.22 2.18,28.2 5.27,30.99 1.83,23.62 9.65,30.48 14.86,28.98 17.71,29.01 34.75,28.91 37.95,28.93 24.04,31.47 30.37,31.47 60.91,35.21 64.08,32.42 64.12,38.72 32.51,42.59 35.04,41.51 37.62,41.52 52.8,43.1 55.34,43.08 50.3,55.45 52.84,55.42 55.41,55.42 57.98,55.39 50.16,31.1 54.77,28.9 58.08,28.96 54.78,31.49 20.15,58.75 58.41,62.95 62.33,66.69 67.38,60.64 67.86,56.17 67.75,51.9 61.96,52.96 61.85,45.27 12.46,56.92 19.02,50.34 41.56,35.45
  pour Top: 0.15,85.41 81.96,85.41 81.96,0 0.15,0
  pour Bottom: 0,85.42 81.83,85.42 81.83,0.16 0,0.16
HV2
  Bottom 0.508: 3.43,19.37 D13.C
  Bottom 0.813: VALVE1.1 5.54,6.95 10.06,11.46 12.79,11.46 14.63,13.3 14.63,18.64 13.23,20.04 IC3.6 11.03,20.04 10.15,20.92 4.99,20.92 3.43,19.37
HV3
  Bottom 0.813: VALVE1.2 10.62,6.96 15.74,12.08 15.69,12.13 15.69,24.93 12.96,27.66 IC3.3 D12.C
HV4
  Bottom 0.813: VALVE1.3 15.7,8.59 16.86,9.74 16.86,24.34 IC3.14 D18.C
HV5
  Bottom 0.813: VALVE1.4 20.78,7.01 18.01,9.79 18.01,18.13 19.92,20.04 IC3.11 D19.C
HV6
  Bottom 0.813: VALVE2.1 26.01,5.53 34.56,14.08 34.56,19.84 34.28,20.11 IC2.6 D15.C
HV7
  Bottom 0.813: D14.C IC2.3 34.16,27.73 35.77,26.12 35.77,12.16 35.22,11.6 35.22,8.14 34.25,7.18 32.28,7.18 31.09,5.99 VALVE2.2
HV8
  Bottom 0.813: D16.C 43.83,27.73 IC2.14 38.64,27.73 36.92,26.02 36.92,11.95 36.18,11.2 36.18,7.74 36.17,7.73 VALVE2.3
HV9
  Bottom 0.813: D17.C IC2.11 39.07,20.11 38.16,19.2 38.16,13.87 41.25,10.78 VALVE2.4
HV10
  Bottom 0.813: VALVE3.1 46.49,6.08 54.72,14.31 54.72,19.11 53.8,20.03 IC1.6 52.59,20.05 D9.C
HV11
  Bottom 0.813: VALVE3.2 51.57,9.03 55.84,13.29 55.84,26.48 54.66,27.65 IC1.3 D8.C
HV12
  Bottom 0.813: VALVE3.3 56.65,11.8 57.09,12.24 57.09,26.22 58.52,27.65 IC1.14 60.41,27.47 D11.C
HV13
  Bottom 0.813: VALVE3.4 61.73,10.43 58.3,13.85 58.3,19.19 59.15,20.03 IC1.11 63.94,20.03 D10.C
LLED
  Top 0.508: U1.7 28.97,79.71 31.1,79.71 | 31.1,79.71 31.1,78.5 31.04,78.43 31,78.48 U1.6 | 31.1,79.71 31.1,80.33 R6.1
N$2
  Top 0.508: C1.2 28.45,69.16 Q1.2 24.11,69.16 22.91,67.96 R8.2 19.74,67.96 19.04,67.26 17.17,67.26 U$1.8
N$3
  Top 0.508: C2.2 28.77,64.08 Q1.1 23.85,64.08 22.86,65.07 R8.1 19.77,65.07 18.87,65.97 18.12,65.97 17.24,65.97 17.19,65.97 U$1.7
N$4
  Top 0.508: USB_COM.2 13.66,71.7 14.72,70.64 14.72,65.02 14.98,64.76 U$1.6
N$5
  Top 0.508: AT-MEGA328P-PU.9 46.48,41.23 R11.1 | R11.1 43.32,41.07 C3.1 | R11.1 46.32,38.39 Q2.1
N$6
  Top 0.508: AT-MEGA328P-PU.10 49.02,41.26 R11.2 | R11.2 52.35,41.07 C4.1 | R11.2 49.21,38.65 Q2.2
N$7
  Top 0.508: U$1.5 14.37,63.48 13.87,63.99 13.87,70.56 12.43,72 12.43,74.49 USB_COM.3
N$14
  Top 0.508: U1.3 24.04,78.43 22.16,78.43 20.31,76.59 R3.2 22.57,72.59 R2.2
N$16
  Top 0.508: RST-EN.2 23.64,43.44 23.55,43.53 20.42,43.53 C5.2
N$30
  Top 0.508: R9.1 38.36,75.94 TX.A
N$51
  Top 0.508: R10.1 35.46,73.56 RX.A
N$54
  Top 0.508: C6.1 43.88,53.05 AT-MEGA328P-PU.21
P13LED
  Top 0.508: R6.2 38.39,81.69 L.A
PWRLED
  Top 0.508: R7.2 35.4,83.82 ON.A
RST  (via drill 0.35)
  Top 0.508: AT-MEGA328P-PU.1 26.22,45.3 26.22,39.37 25.13,38.27 R1.1 23.64,39.48 RST-EN.1 | v47.76,56.7 47.76,57.29 v49,58.53
  Bottom 0.508: AT-MEGA328P-PU.1 26.16,47.3 26.54,47.68 31.92,47.68 35.09,50.86 35.09,54.27 38.32,57.49 46.97,57.49 v47.76,56.7 | v49,58.53 51.31,60.84 54.47,60.84 56.06,62.43 ICSP.5
SCL
  Top 0.508: AT-MEGA328P-PU.28 29.87,56.69 31.65,56.69 35.97,61 35.97,67.45 37.62,69.1 40.66,69.1 41.39,68.37 41.39,67.68 LCD.4
SDA
  Top 0.508: AT-MEGA328P-PU.27 28.7,54.58 30.15,56.03 31.92,56.03 36.63,60.74 36.63,67.03 37.23,67.64 LCD.2
UART-RX
  Top 0.508: AT-MEGA328P-PU.2 28.7,47.1 27.91,47.89 24.03,47.89 23.56,48.37 23.56,54.98 26.26,57.68 31.13,57.68 32.59,59.14 32.59,59.9 R5.2 34.12,60.09 35.22,61.19 35.22,69.73 36.64,71.16 40.5,71.16 41.91,72.56 RX.C 43.69,73.56 49.32,79.2 52.34,79.2 53.05,79.91 UART.1
  Bottom 0.508: TEST.1 28.73,45.33 AT-MEGA328P-PU.2
UART-TX  (via drill 0.35)
  Top 0.508: AT-MEGA328P-PU.3 31.24,47.36 29.82,48.78 v24.68,48.78 | v22.71,49.3 22.74,49.32 22.74,55.54 25.68,58.49 30.37,58.49 31.13,59.24 31.13,61.4 32.08,62.34 R4.2 33.73,62.34 34.49,63.11 34.49,70.07 36.26,71.83 39.34,71.83 40.22,72.71 40.22,75.14 40.97,75.88 TX.C 44.21,75.88 47.97,79.64 UART.2
  Bottom 0.508: v22.71,49.3 24.16,49.3 v24.68,48.78 | TEST.2 31.27,45.33 AT-MEGA328P-PU.3
USB5V
  Top 1.27: F1.2 8.62,83.69 10.39,81.92 10.39,79.45 9.57,78.63 9.57,74.9 10.75,73.72 USB_COM.1
USB-RX
  Top 0.508: U$1.3 27.94,60.95 29.41,62.42 29.84,62.42 R4.1
USB-TX
  Top 0.508: U$1.2 24.53,59.67 24.53,59.68 29.48,59.68 R5.1
V+  (via drill 0.35)
  Top 0.508: v4.69,46.84 4.69,48.04 PC3.+ 8.1,45.12 C9.1 | R3.1 30.46,74.84 31.28,74.03 31.28,72.75 32.1,71.93 33.01,71.93 33.92,72.84 33.92,76.86 35.02,77.95 42.35,77.95 45.12,80.72 45.12,83.89 45.67,84.44 65.25,84.44 65.95,83.73 65.95,81.18 70.97,76.16 71.39,76.16 v71.44,76.1 73.56,73.98 C7.1
  Top 1.016: PC1.+ 70.75,62.07 69.42,63.4 U2.3 71.44,69.71 v71.44,76.1 71.5,76.16 77.12,76.16 D7.C
  Bottom 0.508: v4.69,46.84 4.9,47.05 6.58,47.05 6.92,47.4 U3.3
  Bottom 0.813: v71.44,76.1 51.89,76.1 45.51,69.72 45.51,64.23 42.51,61.23 24.86,61.23 21.38,57.76 21.38,50.71 19.68,49.01 15.86,49.01 10.15,54.71 8.62,54.71 6.97,54.71 U3.3
VIN
  Top 1.27: BOARD_PWR.2 72.27,77.86 75.83,77.86 75.83,79.27 D7.A

### Text on the board
tPlace: A0 | +5V | VIN | GND | IrriPRO | V2 | V3 | V4 | V5 | V6 | V7 | V8 | V9 | V10 | V11 | V12 | V13 | +9V | +24V | GND
bPlace: A0 | +5V | VIN | GND | TX | RX | Jacopo Pellizzari - jacopisky@gmail.com / 03/12/2019 version 2 | V2 | V3 | V4 | V5 | V6 | V7 | V8 | V9 | V10 | V11 | V12 | V13 | +9V | +24V | GND